# Altium project RF-BPF.PrjPcb
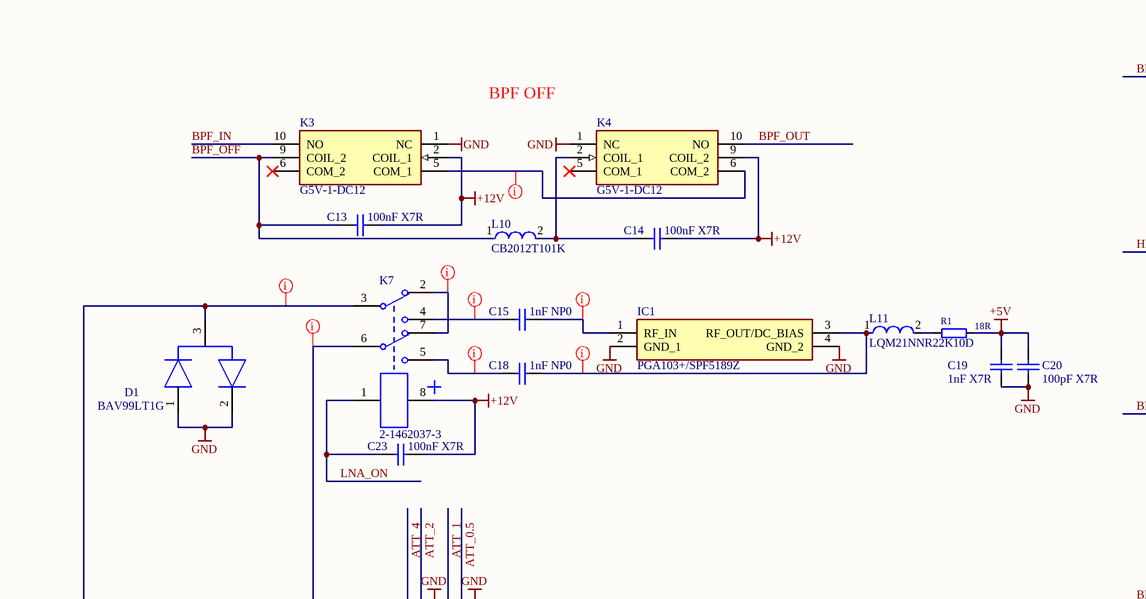
[diagram p0: RF-BPF.SchDoc, top left]
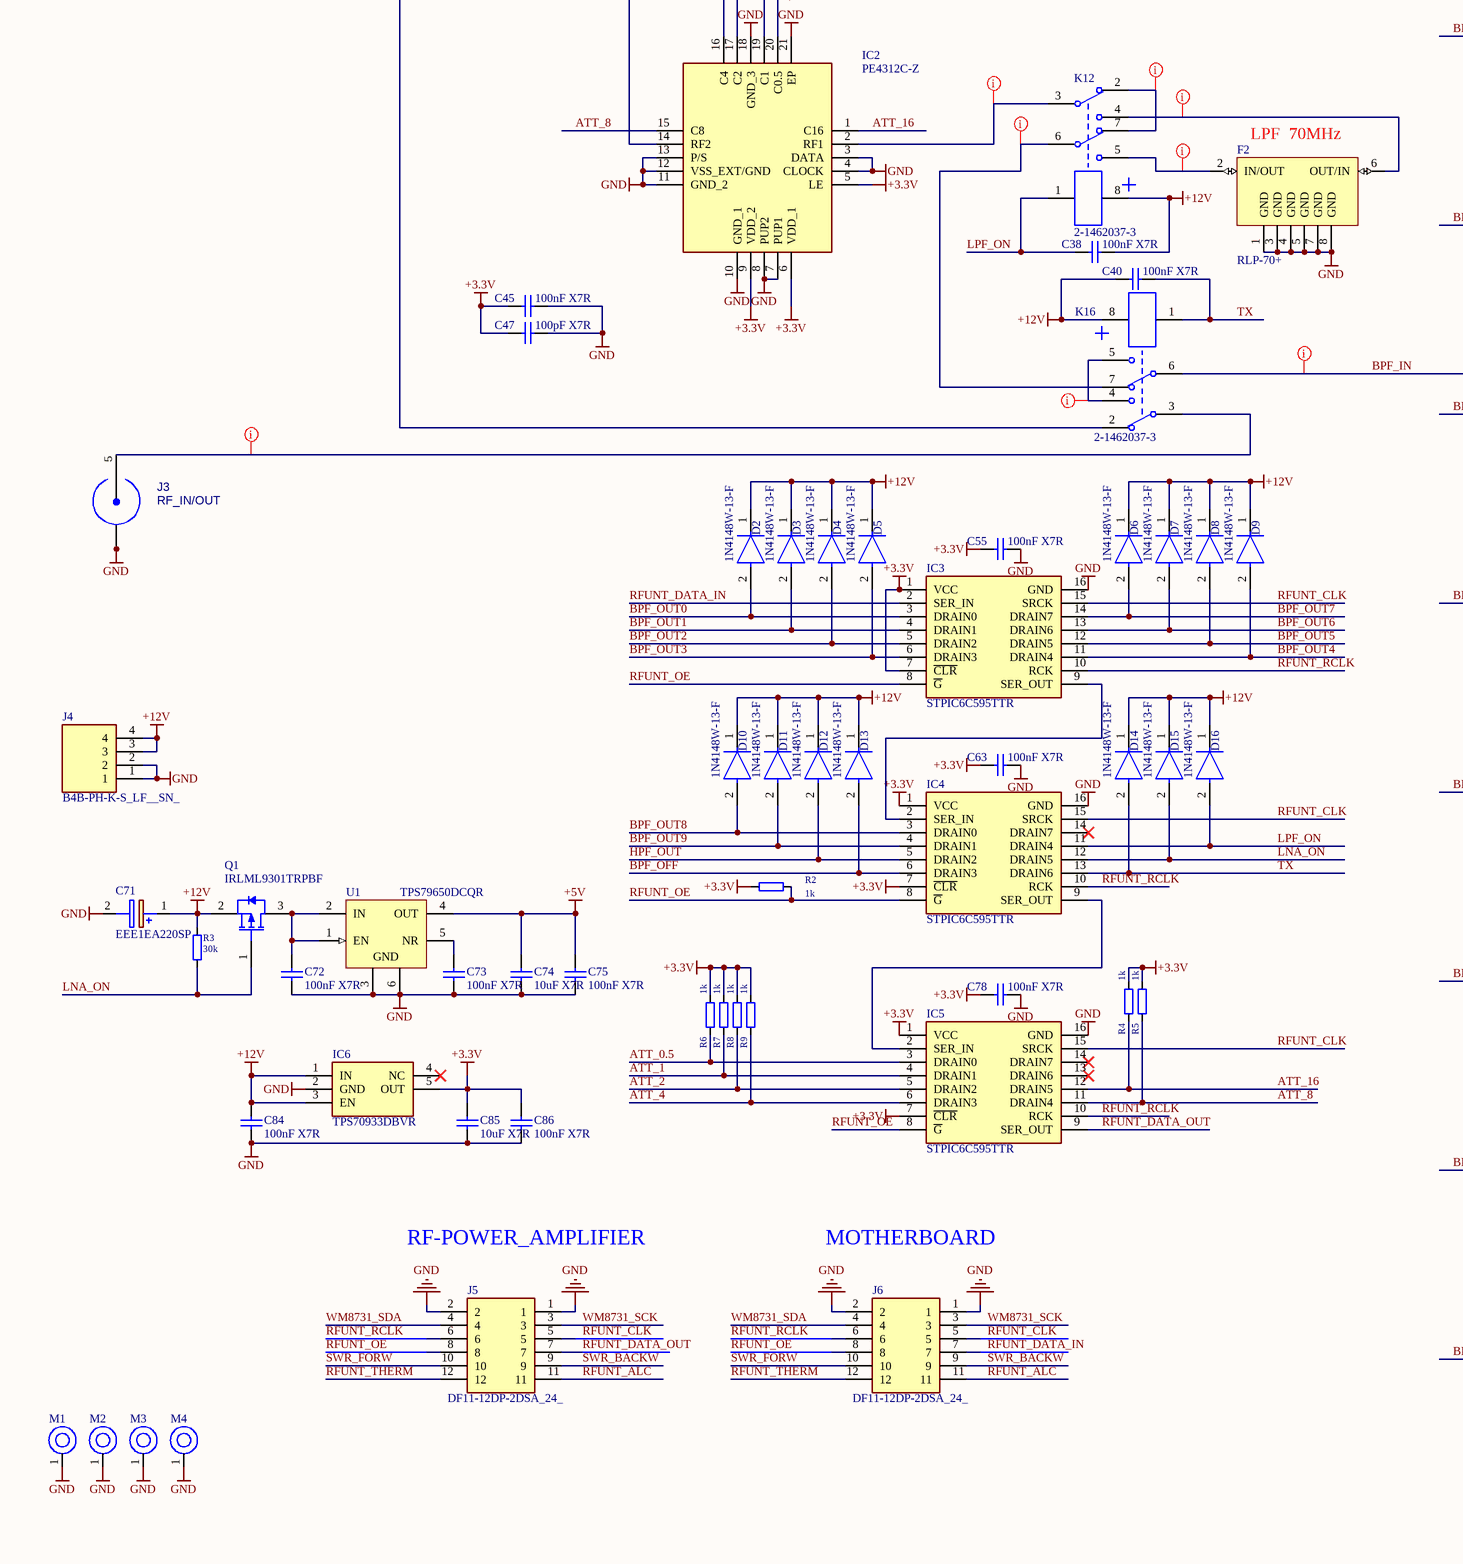
[diagram p1: RF-BPF.SchDoc, bottom left]
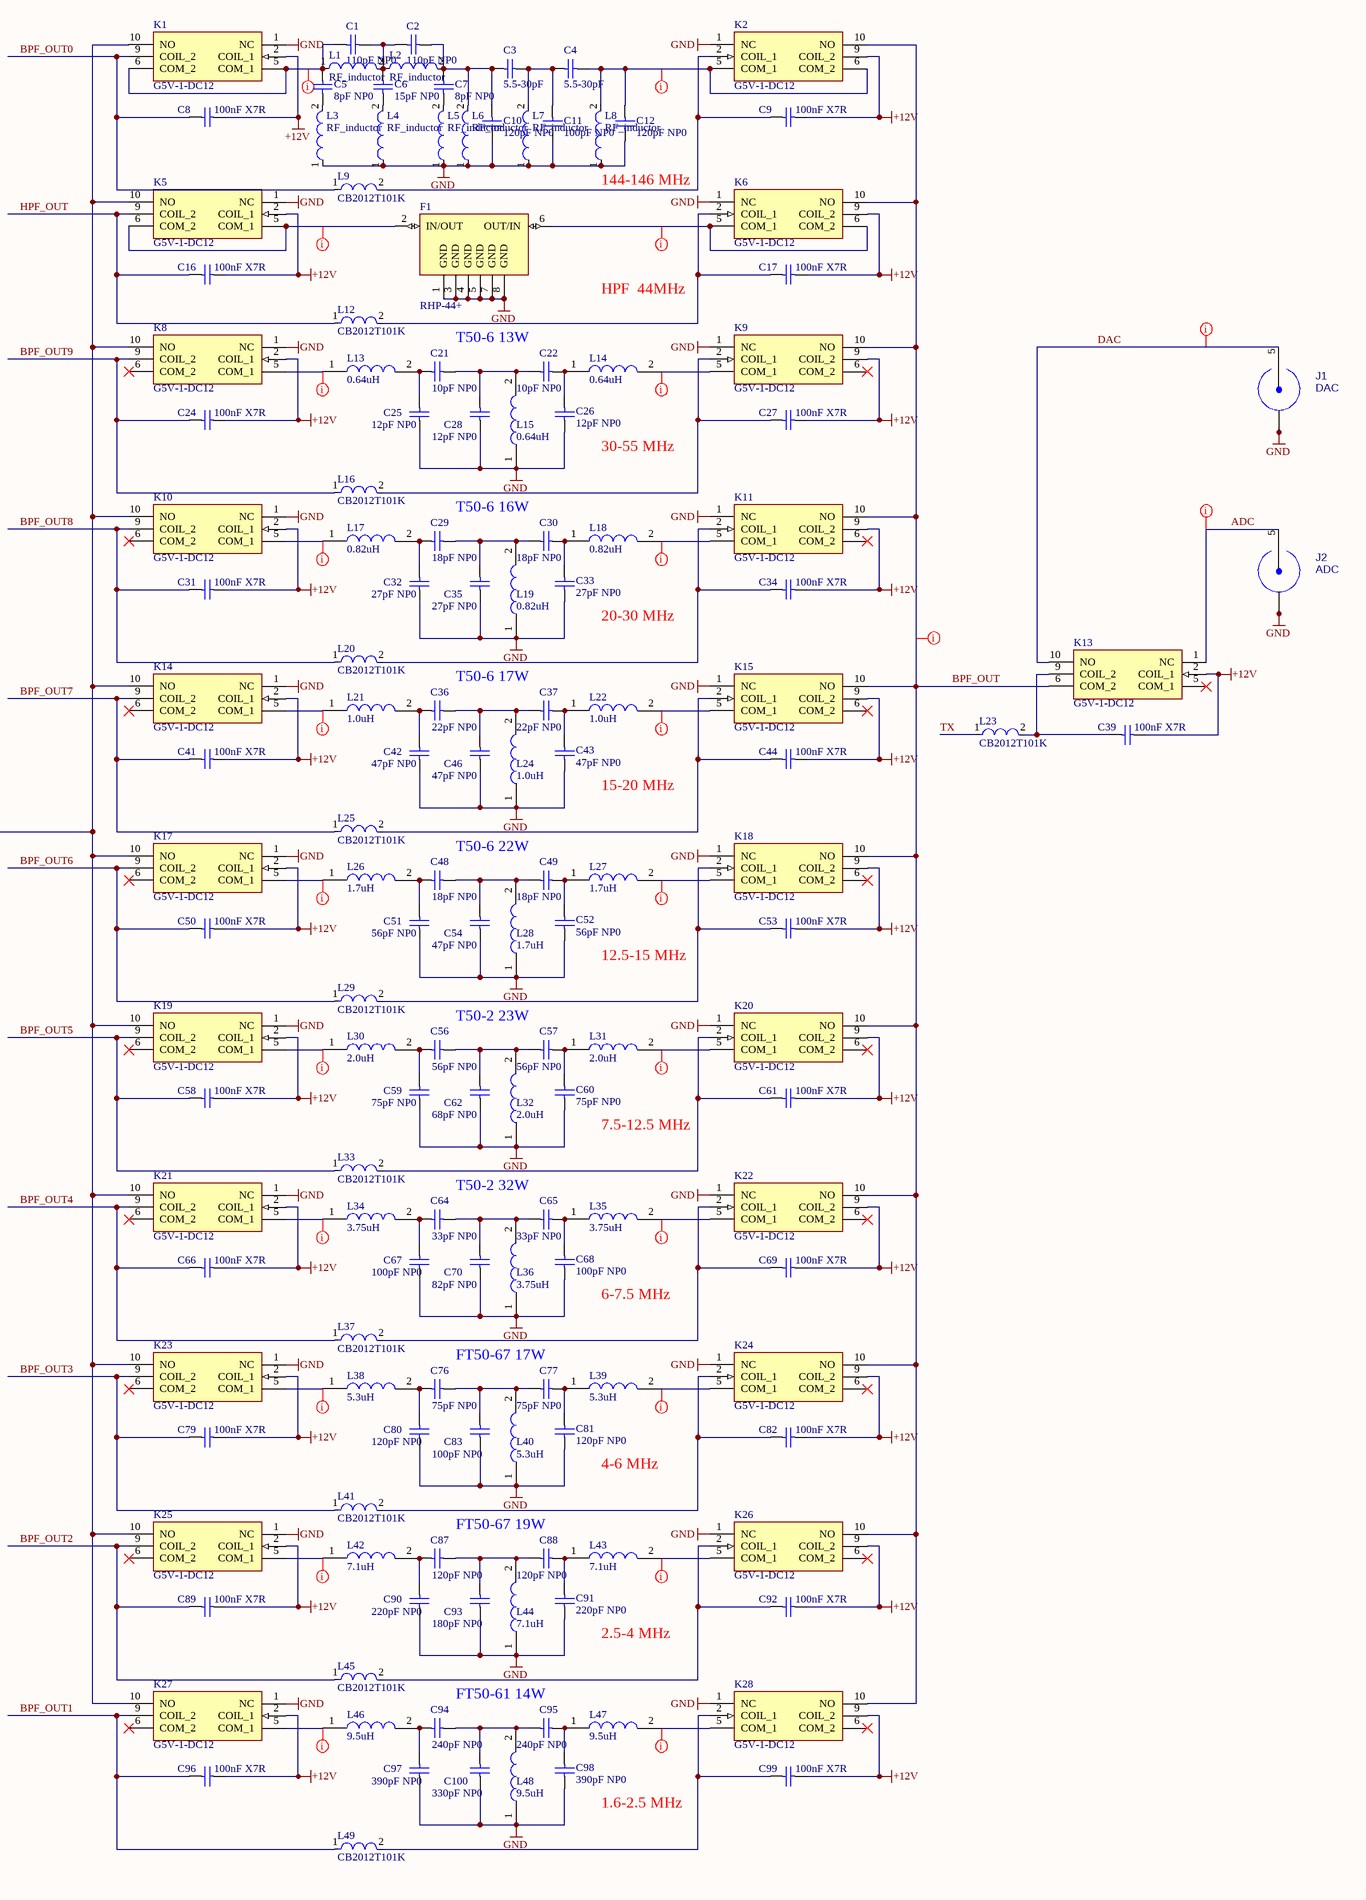
[diagram p2: RF-BPF.SchDoc, bottom right]
1 sheet, 222 parts. Net scope: global (net labels, ports and power ports of the same name join across sheets).
Board file: RF-BPF.PcbDoc

## Sheet RF-BPF.SchDoc
size A2; SheetNumber: 1; SheetTotal: 1

### Parts
C1  110pF NP0  [C-0805]
C2  110pF NP0  [C-0805]
C3  5.5-30pF  [CAP-ADJ-SMD_L4.5-W3.2-L]
C4  5.5-30pF  [CAP-ADJ-SMD_L4.5-W3.2-L]
C5  8pF NP0  [C-0805]
C6  15pF NP0  [C-0805]
C7  8pF NP0  [C-0805]
C8  100nF X7R  [C-0805]
C9  100nF X7R  [C-0805]
C10  120pF NP0  [C-0805]
C11  100pF NP0  [C-0805]
C12  120pF NP0  [C-0805]
C13  100nF X7R  [C-0805]
C14  100nF X7R  [C-0805]
C15  1nF NP0  [C-0805]
C16  100nF X7R  [C-0805]
C17  100nF X7R  [C-0805]
C18  1nF NP0  [C-0805]
C19  1nF X7R  [C-0603]
C20  100pF X7R  [C-0603]
C21  10pF NP0  [C-0805]
C22  10pF NP0  [C-0805]
C23  100nF X7R  [C-0805]
C24  100nF X7R  [C-0805]
C25  12pF NP0  [C-0805]
C26  12pF NP0  [C-0805]
C27  100nF X7R  [C-0805]
C28  12pF NP0  [C-0805]
C29  18pF NP0  [C-0805]
C30  18pF NP0  [C-0805]
C31  100nF X7R  [C-0805]
C32  27pF NP0  [C-0805]
C33  27pF NP0  [C-0805]
C34  100nF X7R  [C-0805]
C35  27pF NP0  [C-0805]
C36  22pF NP0  [C-0805]
C37  22pF NP0  [C-0805]
C38  100nF X7R  [C-0805]
C39  100nF X7R  [C-0805]
C40  100nF X7R  [C-0805]
C41  100nF X7R  [C-0805]
C42  47pF NP0  [C-0805]
C43  47pF NP0  [C-0805]
C44  100nF X7R  [C-0805]
C45  100nF X7R  [C-0603]
C46  47pF NP0  [C-0805]
C47  100pF X7R  [C-0603]
C48  18pF NP0  [C-0805]
C49  18pF NP0  [C-0805]
C50  100nF X7R  [C-0805]
C51  56pF NP0  [C-0805]
C52  56pF NP0  [C-0805]
C53  100nF X7R  [C-0805]
C54  47pF NP0  [C-0805]
C55  100nF X7R  [C-0603]
C56  56pF NP0  [C-0805]
C57  56pF NP0  [C-0805]
C58  100nF X7R  [C-0805]
C59  75pF NP0  [C-0805]
C60  75pF NP0  [C-0805]
C61  100nF X7R  [C-0805]
C62  68pF NP0  [C-0805]
C63  100nF X7R  [C-0603]
C64  33pF NP0  [C-0805]
C65  33pF NP0  [C-0805]
C66  100nF X7R  [C-0805]
C67  100pF NP0  [C-0805]
C68  100pF NP0  [C-0805]
C69  100nF X7R  [C-0805]
C70  82pF NP0  [C-0805]
C71  EEE1EA220SP  [EEE1AA101SP]
C72  100nF X7R  [C-0603]
C73  100nF X7R  [C-0603]
C74  10uF X7R  [C-0603]
C75  100nF X7R  [C-0603]
C76  75pF NP0  [C-0805]
C77  75pF NP0  [C-0805]
C78  100nF X7R  [C-0603]
C79  100nF X7R  [C-0805]
C80  120pF NP0  [C-0805]
C81  120pF NP0  [C-0805]
C82  100nF X7R  [C-0805]
C83  100pF NP0  [C-0805]
C84  100nF X7R  [C-0603]
C85  10uF X7R  [C-0603]
C86  100nF X7R  [C-0603]
C87  120pF NP0  [C-0805]
C88  120pF NP0  [C-0805]
C89  100nF X7R  [C-0805]
C90  220pF NP0  [C-0805]
C91  220pF NP0  [C-0805]
C92  100nF X7R  [C-0805]
C93  180pF NP0  [C-0805]
C94  240pF NP0  [C-0805]
C95  240pF NP0  [C-0805]
C96  100nF X7R  [C-0805]
C97  390pF NP0  [C-0805]
C98  390pF NP0  [C-0805]
C99  100nF X7R  [C-0805]
C100  330pF NP0  [C-0805]
D1  BAV99LT1G  [FP-318-08-MFG]
D2  1N4148W-13-F  [FP-SOD123-MFG]
D3  1N4148W-13-F  [FP-SOD123-MFG]
D4  1N4148W-13-F  [FP-SOD123-MFG]
D5  1N4148W-13-F  [FP-SOD123-MFG]
D6  1N4148W-13-F  [FP-SOD123-MFG]
D7  1N4148W-13-F  [FP-SOD123-MFG]
D8  1N4148W-13-F  [FP-SOD123-MFG]
D9  1N4148W-13-F  [FP-SOD123-MFG]
D10  1N4148W-13-F  [FP-SOD123-MFG]
D11  1N4148W-13-F  [FP-SOD123-MFG]
D12  1N4148W-13-F  [FP-SOD123-MFG]
D13  1N4148W-13-F  [FP-SOD123-MFG]
D14  1N4148W-13-F  [FP-SOD123-MFG]
D15  1N4148W-13-F  [FP-SOD123-MFG]
D16  1N4148W-13-F  [FP-SOD123-MFG]
F1  RHP-44+  [GP731]
F2  RLP-70+  [GP731]
IC1  PGA103+/SPF5189Z  [SPF5189Z]
IC2  PE4312C-Z  [QFN50P400X400X90-21N-D]
IC3  STPIC6C595TTR  [SOP65P640X120-16N]
IC4  STPIC6C595TTR  [SOP65P640X120-16N]
IC5  STPIC6C595TTR  [SOP65P640X120-16N]
IC6  TPS70933DBVR  [SOT95P280X145-5N]
J1  value DAC  [31-5431]  (hidden comment: ADC)
J2  ADC  [31-5431]
J3  value RF_IN/OUT  [31-5431]  (hidden comment: ADC)
J4  B4B-PH-K-S_LF__SN_  [SHDR4W50P0X200_1X4_990X450X600P]
J5  DF11-12DP-2DSA_24_  [SHDR12W60P200_2X6_1400X500X690P]
J6  DF11-12DP-2DSA_24_  [SHDR12W60P200_2X6_1400X500X690P]
K1  G5V-1-DC12  [G5V1DC12]
K2  G5V-1-DC12  [G5V1DC12]
K3  G5V-1-DC12  [G5V1DC12]
K4  G5V-1-DC12  [G5V1DC12]
K5  G5V-1-DC12  [G5V1DC12]
K6  G5V-1-DC12  [G5V1DC12]
K7  2-1462037-3  [TECO-2-1462037-3_V]
K8  G5V-1-DC12  [G5V1DC12]
K9  G5V-1-DC12  [G5V1DC12]
K10  G5V-1-DC12  [G5V1DC12]
K11  G5V-1-DC12  [G5V1DC12]
K12  2-1462037-3  [TECO-2-1462037-3_V]
K13  G5V-1-DC12  [G5V1DC12]
K14  G5V-1-DC12  [G5V1DC12]
K15  G5V-1-DC12  [G5V1DC12]
K16  2-1462037-3  [TECO-2-1462037-3_V]
K17  G5V-1-DC12  [G5V1DC12]
K18  G5V-1-DC12  [G5V1DC12]
K19  G5V-1-DC12  [G5V1DC12]
K20  G5V-1-DC12  [G5V1DC12]
K21  G5V-1-DC12  [G5V1DC12]
K22  G5V-1-DC12  [G5V1DC12]
K23  G5V-1-DC12  [G5V1DC12]
K24  G5V-1-DC12  [G5V1DC12]
K25  G5V-1-DC12  [G5V1DC12]
K26  G5V-1-DC12  [G5V1DC12]
K27  G5V-1-DC12  [G5V1DC12]
K28  G5V-1-DC12  [G5V1DC12]
L1  RF_inductor  [L-2520]
L2  RF_inductor  [L-2520]
L3  RF_inductor  [3.81x3.43x4.95]
L4  RF_inductor  [3.81x3.43x4.95]
L5  RF_inductor  [3.81x3.43x4.95]
L6  RF_inductor  [L-0805]
L7  RF_inductor  [L-0805]
L8  RF_inductor  [L-0805]
L9  CB2012T101K  [FP-CB2012-MFG]
L10  CB2012T101K  [FP-CB2012-MFG]
L11  LQM21NNR22K10D  [FP-LQM21DN_00-IPC_C]
L12  CB2012T101K  [FP-CB2012-MFG]
L13  0.64uH  [Amidon_T50_6]
L14  0.64uH  [Amidon_T50_6]
L15  0.64uH  [Amidon_T50_6]
L16  CB2012T101K  [FP-CB2012-MFG]
L17  0.82uH  [Amidon_T50_6]
L18  0.82uH  [Amidon_T50_6]
L19  0.82uH  [Amidon_T50_6]
L20  CB2012T101K  [FP-CB2012-MFG]
L21  1.0uH  [Amidon_T50_6]
L22  1.0uH  [Amidon_T50_6]
L23  CB2012T101K  [FP-CB2012-MFG]
L24  1.0uH  [Amidon_T50_6]
L25  CB2012T101K  [FP-CB2012-MFG]
L26  1.7uH  [Amidon_T50_6]
L27  1.7uH  [Amidon_T50_6]
L28  1.7uH  [Amidon_T50_6]
L29  CB2012T101K  [FP-CB2012-MFG]
L30  2.0uH  [Amidon_T50_2]
L31  2.0uH  [Amidon_T50_2]
L32  2.0uH  [Amidon_T50_2]
L33  CB2012T101K  [FP-CB2012-MFG]
L34  3.75uH  [Amidon_T50_2]
L35  3.75uH  [Amidon_T50_2]
L36  3.75uH  [Amidon_T50_2]
L37  CB2012T101K  [FP-CB2012-MFG]
L38  5.3uH  [Amidon_FT50_6x]
L39  5.3uH  [Amidon_FT50_6x]
L40  5.3uH  [Amidon_FT50_6x]
L41  CB2012T101K  [FP-CB2012-MFG]
L42  7.1uH  [Amidon_FT50_6x]
L43  7.1uH  [Amidon_FT50_6x]
L44  7.1uH  [Amidon_FT50_6x]
L45  CB2012T101K  [FP-CB2012-MFG]
L46  9.5uH  [Amidon_FT50_6x]
L47  9.5uH  [Amidon_FT50_6x]
L48  9.5uH  [Amidon_FT50_6x]
L49  CB2012T101K  [FP-CB2012-MFG]
M1  MountHole  [MountHole]  (value not drawn)
M2  MountHole  [MountHole]  (value not drawn)
M3  MountHole  [MountHole]  (value not drawn)
M4  MountHole  [MountHole]  (value not drawn)
Q1  IRLML9301TRPBF  [INF-SOT-23-3_V]
R1  18R  [R-0603]
R2  1k  [R-0603]
R3  30k  [R-0603]
R4  1k  [R-0603]
R5  1k  [R-0603]
R6  1k  [R-0603]
R7  1k  [R-0603]
R8  1k  [R-0603]
R9  1k  [R-0603]
U1  TPS79650DCQR  [DCQ0006A_L]

### Nets
+3.3V: C45.1 C47.1 C55.1 C63.1 C78.1 C85.2 C86.2 IC2.5(LE) IC2.6(VDD_1) IC2.9(VDD_2) IC3.1(VCC) IC3.7(~{CLR}) IC4.1(VCC) IC4.7(~{CLR}) IC5.1(VCC) IC5.7(~{CLR}) IC6.5(OUT) R2.2 R4.2 R5.2 R6.2 R7.2 R8.2 R9.2
+5V: C19.2 C20.2 C74.2 C75.2 R1.2 U1.4(OUT)
+12V: C8.2 C9.2 C13.2 C14.2 C16.2 C17.2 C23.2 C24.2 C27.2 C31.2 C34.2 C38.2 C39.2 C40.2 C41.2 C44.2 C50.2 C53.2 C58.2 C61.2 C66.2 C69.2 C71.1(+) C79.2 C82.2 C84.2 C89.2 C92.2 C96.2 C99.2 D2.1(C) D3.1(C) D4.1(C) D5.1(C) D6.1(C) D7.1(C) D8.1(C) D9.1(C) D10.1(C) D11.1(C) D12.1(C) D13.1(C) D14.1(C) D15.1(C) D16.1(C) IC6.1(IN) IC6.3(EN) J4.3 J4.4 K1.2(COIL_1) K2.9(COIL_2) K3.2(COIL_1) K4.9(COIL_2) K5.2(COIL_1) K6.9(COIL_2) K7.8 K8.2(COIL_1) K9.9(COIL_2) K10.2(COIL_1) K11.9(COIL_2) K12.8 K13.2(COIL_1) K14.2(COIL_1) K15.9(COIL_2) K16.8 K17.2(COIL_1) K18.9(COIL_2) K19.2(COIL_1) K20.9(COIL_2) K21.2(COIL_1) K22.9(COIL_2) K23.2(COIL_1) K24.9(COIL_2) K25.2(COIL_1) K26.9(COIL_2) K27.2(COIL_1) K28.9(COIL_2) Q1.2(SOURCE) R3.1
GND: C10.2 C11.2 C12.2 C19.1 C20.1 C25.2 C26.2 C28.2 C32.2 C33.2 C35.2 C42.2 C43.2 C45.2 C46.2 C47.2 C51.2 C52.2 C54.2 C55.2 C59.2 C60.2 C62.2 C63.2 C67.2 C68.2 C70.2 C71.2(-) C72.1 C73.1 C74.1 C75.1 C78.2 C80.2 C81.2 C83.2 C84.1 C85.1 C86.1 C90.2 C91.2 C93.2 C97.2 C98.2 C100.2 D1.1(A) D1.2(C) F1.1(GND) F1.3(GND) F1.4(GND) F1.5(GND) F1.7(GND) F1.8(GND) F2.1(GND) F2.3(GND) F2.4(GND) F2.5(GND) F2.7(GND) F2.8(GND) IC1.2(GND_1) IC1.4(GND_2) IC2.3(DATA) IC2.4(CLOCK) IC2.7(PUP1) IC2.8(PUP2) IC2.10(GND_1) IC2.11(GND_2) IC2.12(VSS_EXT/GND) IC2.13(P/S) IC2.18(GND_3) IC2.21(EP) IC3.16(GND) IC4.16(GND) IC5.16(GND) IC6.2(GND) J1.1(GND) J1.2(GND) J1.3(GND) J1.4(GND) J2.1(GND) J2.2(GND) J2.3(GND) J2.4(GND) J3.1(GND) J3.2(GND) J3.3(GND) J3.4(GND) J4.1 J4.2 J5.1 J5.2 J6.1 J6.2 K1.1(NC) K2.1(NC) K3.1(NC) K4.1(NC) K5.1(NC) K6.1(NC) K8.1(NC) K9.1(NC) K10.1(NC) K11.1(NC) K14.1(NC) K15.1(NC) K17.1(NC) K18.1(NC) K19.1(NC) K20.1(NC) K21.1(NC) K22.1(NC) K23.1(NC) K24.1(NC) K25.1(NC) K26.1(NC) K27.1(NC) K28.1(NC) L3.1 L4.1 L5.1 L6.1 L7.1 L8.1 L15.1 L19.1 L24.1 L28.1 L32.1 L36.1 L40.1 L44.1 L48.1 M1.1 M2.1 M3.1 M4.1 U1.3(GND) U1.6(GND)
ADC: J2.5(CON) K13.1(NC)
ATT_0.5: IC2.20(C0.5) IC5.3(DRAIN0) R6.1
ATT_1: IC2.19(C1) IC5.4(DRAIN1) R7.1
ATT_2: IC2.17(C2) IC5.5(DRAIN2) R8.1
ATT_4: IC2.16(C4) IC5.6(DRAIN3) R9.1
ATT_8: IC2.15(C8) IC5.11(DRAIN4) R5.1
ATT_16: IC2.1(C16) IC5.12(DRAIN5) R4.1
BPF_IN: K1.10(NO) K3.10(NO) K5.10(NO) K8.10(NO) K10.10(NO) K14.10(NO) K16.6 K17.10(NO) K19.10(NO) K21.10(NO) K23.10(NO) K25.10(NO) K27.10(NO)
BPF_OFF: C13.1 D13.2(A) IC4.6(DRAIN3) K3.9(COIL_2) L10.1
BPF_OUT: K2.10(NO) K4.10(NO) K6.10(NO) K9.10(NO) K11.10(NO) K13.6(COM_2) K15.10(NO) K18.10(NO) K20.10(NO) K22.10(NO) K24.10(NO) K26.10(NO) K28.10(NO)
BPF_OUT0: C8.1 D2.2(A) IC3.3(DRAIN0) K1.9(COIL_2) L9.1
BPF_OUT1: C96.1 D3.2(A) IC3.4(DRAIN1) K27.9(COIL_2) L49.1
BPF_OUT2: C89.1 D4.2(A) IC3.5(DRAIN2) K25.9(COIL_2) L45.1
BPF_OUT3: C79.1 D5.2(A) IC3.6(DRAIN3) K23.9(COIL_2) L41.1
BPF_OUT4: C66.1 D9.2(A) IC3.11(DRAIN4) K21.9(COIL_2) L37.1
BPF_OUT5: C58.1 D8.2(A) IC3.12(DRAIN5) K19.9(COIL_2) L33.1
BPF_OUT6: C50.1 D7.2(A) IC3.13(DRAIN6) K17.9(COIL_2) L29.1
BPF_OUT7: C41.1 D6.2(A) IC3.14(DRAIN7) K14.9(COIL_2) L25.1
BPF_OUT8: C31.1 D10.2(A) IC4.3(DRAIN0) K10.9(COIL_2) L20.1
BPF_OUT9: C24.1 D11.2(A) IC4.4(DRAIN1) K8.9(COIL_2) L16.1
DAC: J1.5(CON) K13.10(NO)
HPF_OUT: C16.1 D12.2(A) IC4.5(DRAIN2) K5.9(COIL_2) L12.1
LNA_ON: C23.1 D15.2(A) IC4.12(DRAIN5) K7.1 Q1.1(GATE) R3.2
LPF_ON: C38.1 D16.2(A) IC4.11(DRAIN4) K12.1
RFUNT_ALC: J5.11 J6.11
RFUNT_CLK: IC3.15(SRCK) IC4.15(SRCK) IC5.15(SRCK) J5.5 J6.5
RFUNT_DATA_IN: IC3.2(SER_IN) J6.7
RFUNT_DATA_OUT: IC5.9(SER_OUT) J5.7
RFUNT_OE: IC3.8(~{G}) IC4.8(~{G}) IC5.8(~{G}) J5.8 J6.8 R2.1
RFUNT_RCLK: IC3.10(RCK) IC4.10(RCK) IC5.10(RCK) J5.6 J6.6
RFUNT_THERM: J5.12 J6.12
SWR_BACKW: J5.9 J6.9
SWR_FORW: J5.10 J6.10
TX: C40.1 D14.2(A) IC4.13(DRAIN6) K16.1 L23.1
WM8731_SCK: J5.3 J6.3
WM8731_SDA: J5.4 J6.4
NetC1_1: C1.1 C2.2 C6.2 L1.2 L2.1
NetC1_2: C1.2 C5.2 K1.5(COM_1) K1.6(COM_2) L1.1
NetC2_1: C2.1 C3.1 C7.2 C10.1 L2.2 L6.2
NetC3_2: C3.2 C4.1 C11.1 L7.2
NetC4_2: C4.2 C12.1 K2.5(COM_1) K2.6(COM_2) L8.2
NetC5_1: C5.1 L3.2
NetC6_1: C6.1 L4.2
NetC7_1: C7.1 L5.2
NetC9_1: C9.1 K2.2(COIL_1) L9.2
NetC14_1: C14.1 K4.2(COIL_1) L10.2
NetC15_1: C15.1 K7.4
NetC15_2: C15.2 IC1.1(RF_IN)
NetC17_1: C17.1 K6.2(COIL_1) L12.2
NetC18_1: C18.1 K7.5
NetC18_2: C18.2 IC1.3(RF_OUT/DC_BIAS) L11.1
NetC21_1: C21.1 C25.1 L13.2
NetC21_2: C21.2 C22.1 C28.1 L15.2
NetC22_2: C22.2 C26.1 L14.1
NetC27_1: C27.1 K9.2(COIL_1) L16.2
NetC29_1: C29.1 C32.1 L17.2
NetC29_2: C29.2 C30.1 C35.1 L19.2
NetC30_2: C30.2 C33.1 L18.1
NetC34_1: C34.1 K11.2(COIL_1) L20.2
NetC36_1: C36.1 C42.1 L21.2
NetC36_2: C36.2 C37.1 C46.1 L24.2
NetC37_2: C37.2 C43.1 L22.1
NetC39_1: C39.1 K13.9(COIL_2) L23.2
NetC44_1: C44.1 K15.2(COIL_1) L25.2
NetC48_1: C48.1 C51.1 L26.2
NetC48_2: C48.2 C49.1 C54.1 L28.2
NetC49_2: C49.2 C52.1 L27.1
NetC53_1: C53.1 K18.2(COIL_1) L29.2
NetC56_1: C56.1 C59.1 L30.2
NetC56_2: C56.2 C57.1 C62.1 L32.2
NetC57_2: C57.2 C60.1 L31.1
NetC61_1: C61.1 K20.2(COIL_1) L33.2
NetC64_1: C64.1 C67.1 L34.2
NetC64_2: C64.2 C65.1 C70.1 L36.2
NetC65_2: C65.2 C68.1 L35.1
NetC69_1: C69.1 K22.2(COIL_1) L37.2
NetC72_2: C72.2 Q1.3(DRAIN) U1.1(EN) U1.2(IN)
NetC73_2: C73.2 U1.5(NR)
NetC76_1: C76.1 C80.1 L38.2
NetC76_2: C76.2 C77.1 C83.1 L40.2
NetC77_2: C77.2 C81.1 L39.1
NetC82_1: C82.1 K24.2(COIL_1) L41.2
NetC87_1: C87.1 C90.1 L42.2
NetC87_2: C87.2 C88.1 C93.1 L44.2
NetC88_2: C88.2 C91.1 L43.1
NetC92_1: C92.1 K26.2(COIL_1) L45.2
NetC94_1: C94.1 C97.1 L46.2
NetC94_2: C94.2 C95.1 C100.1 L48.2
NetC95_2: C95.2 C98.1 L47.1
NetC99_1: C99.1 K28.2(COIL_1) L49.2
NetD1_3: D1.3(CATHODE/ANODE) K7.3 K16.2
NetF1_2: F1.2(IN/OUT) K5.5(COM_1) K5.6(COM_2)
NetF1_6: F1.6(OUT/IN) K6.5(COM_1) K6.6(COM_2)
NetF2_2: F2.2(IN/OUT) K12.5
NetF2_6: F2.6(OUT/IN) K12.4
NetIC2_2: IC2.2(RF1) K12.3
NetIC2_14: IC2.14(RF2) K7.6
NetIC3_9: IC3.9(SER_OUT) IC4.2(SER_IN)
NetIC4_9: IC4.9(SER_OUT) IC5.2(SER_IN)
NetJ3_5: J3.5(CON) K16.3
NetK3_5: K3.5(COM_1) K4.6(COM_2)
NetK7_2: K7.2 K7.7
NetK8_5: K8.5(COM_1) L13.1
NetK9_5: K9.5(COM_1) L14.2
NetK10_5: K10.5(COM_1) L17.1
NetK11_5: K11.5(COM_1) L18.2
NetK12_2: K12.2 K12.7
NetK12_6: K12.6 K16.7
NetK14_5: K14.5(COM_1) L21.1
NetK15_5: K15.5(COM_1) L22.2
NetK16_4: K16.4 K16.5
NetK17_5: K17.5(COM_1) L26.1
NetK18_5: K18.5(COM_1) L27.2
NetK19_5: K19.5(COM_1) L30.1
NetK20_5: K20.5(COM_1) L31.2
NetK21_5: K21.5(COM_1) L34.1
NetK22_5: K22.5(COM_1) L35.2
NetK23_5: K23.5(COM_1) L38.1
NetK24_5: K24.5(COM_1) L39.2
NetK25_5: K25.5(COM_1) L42.1
NetK26_5: K26.5(COM_1) L43.2
NetK27_5: K27.5(COM_1) L46.1
NetK28_5: K28.5(COM_1) L47.2
NetL11_2: L11.2 R1.1

Not connected (* = marked no-connect by the designer): IC4 14(DRAIN7)*; IC5 13(DRAIN6)* 14(DRAIN7)*; IC6 4(NC)*; K3 6(COM_2)*; K4 5(COM_1)*; K8 6(COM_2)*; K9 6(COM_2)*; K10 6(COM_2)*; K11 6(COM_2)*; K13 5(COM_1)*; K14 6(COM_2)*; K15 6(COM_2)*; K17 6(COM_2)*; K18 6(COM_2)*; K19 6(COM_2)*; K20 6(COM_2)*; K21 6(COM_2)*; K22 6(COM_2)*; K23 6(COM_2)*; K24 6(COM_2)*; K25 6(COM_2)*; K26 6(COM_2)*; K27 6(COM_2)*; K28 6(COM_2)*

### Layout directives
net class RF_SIGNAL_50ohm; rule Width Constraint [Pref Impedance = 50,00ohms    Min Impedance = 50,00ohms    Max Impedance = 50,00ohms]; rule Width Constraint [Pref Impedance = 50,00ohms    Min Impedance = 50,00ohms    Max Impedance = 50,00ohms]: ADC, BPF_IN, BPF_OUT, DAC, NetC1_2, NetC4_2, NetC15_1, NetC15_2, NetC18_1, NetC18_2, NetD1_3, NetF1_2, NetF1_6, NetF2_2, NetF2_6, NetIC2_2, NetIC2_14, NetJ3_5, NetK3_5, NetK7_2, NetK8_5, NetK9_5, NetK10_5, NetK11_5, NetK12_2, NetK12_6, NetK14_5, NetK15_5, NetK16_4, NetK17_5, NetK18_5, NetK19_5, NetK20_5, NetK21_5, NetK22_5, NetK23_5, NetK24_5, NetK25_5, NetK26_5, NetK27_5, NetK28_5

### Notes on the sheet
- BPF OFF
- (near L8) 144-146 MHz
- T50-6 13W
- HPF  44MHz
- (near C26) 30-55 MHz
- T50-6 16W
- (near F2) LPF  70MHz
- (near C33) 20-30 MHz
- T50-6 17W
- (near C43) 15-20 MHz
- T50-6 22W
- (near C52) 12.5-15 MHz
- T50-2 23W
- (near C60) 7.5-12.5 MHz
- T50-2 32W
- (near C68) 6-7.5 MHz
- FT50-67 17W
- (near C81) 4-6 MHz
- FT50-67 19W
- RF-POWER_AMPLIFIER
- MOTHERBOARD
- (near C91) 2.5-4 MHz
- FT50-61 14W
- (near C98) 1.6-2.5 MHz

### Library data of the parts
C1-C20 C23 C24 C27 C31 C34 C38-C41 C44 C45 C47 C50 C53 C55 C58 C61 C63 C66 C69 C72-C75 C78 C79 C82 C84-C86 C89 C92 C96 C99 = C semi: Ceramic Multilayer Capacitor; Manufacturer: Yageo/Phycomp; Manufacturer P/N: CC0603JRNPO9BN102; numsch: 011; TypeNum: 155; Parameters: 1nF, NP0, 50V, ±5%; Tolerance: ±10%; Voltage: *
C21 C22 = C semi: Ceramic Multilayer Capacitor; Manufacturer: Yageo/Phycomp; Manufacturer P/N: CC0805JRNPO9BN100; numsch: 011; TypeNum: 155; Parameters: 1nF, NP0, 50V, ±5%; Tolerance: ±10%; Voltage: *
C25 C26 C28 = C semi: Ceramic Multilayer Capacitor; Manufacturer: Yageo/Phycomp; Manufacturer P/N: CC0805JRNPO9BN120; numsch: 011; TypeNum: 155; Parameters: 1nF, NP0, 50V, ±5%; Tolerance: ±10%; Voltage: *
C29 C30 C48 C49 = C semi: Ceramic Multilayer Capacitor; Manufacturer: Yageo/Phycomp; Manufacturer P/N: CC0805JRNPO9BN180; numsch: 011; TypeNum: 155; Parameters: 1nF, NP0, 50V, ±5%; Tolerance: ±10%; Voltage: *
C32 C33 C35 = C semi: Ceramic Multilayer Capacitor; Manufacturer: Yageo/Phycomp; Manufacturer P/N: GRM21A5C2J270JWA1D; numsch: 011; TypeNum: 155; Parameters: 1nF, NP0, 50V, ±5%; Tolerance: ±10%; Voltage: *
C36 C37 = C semi: Ceramic Multilayer Capacitor; Manufacturer: Yageo/Phycomp; Manufacturer P/N: GRM21A5C2D220JW01D; numsch: 011; TypeNum: 155; Parameters: 1nF, NP0, 50V, ±5%; Tolerance: ±10%; Voltage: *
C42 C43 C46 C54 = C semi: Ceramic Multilayer Capacitor; Manufacturer: Yageo/Phycomp; Manufacturer P/N: CC0805JRNPO9BN470; numsch: 011; TypeNum: 155; Parameters: 1nF, NP0, 50V, ±5%; Tolerance: ±10%; Voltage: *
C51 C52 C56 C57 = C semi: Ceramic Multilayer Capacitor; Manufacturer: Yageo/Phycomp; Manufacturer P/N: CC0805JRNPO9BN560; numsch: 011; TypeNum: 155; Parameters: 1nF, NP0, 50V, ±5%; Tolerance: ±10%; Voltage: *
C59 C60 C76 C77 = C semi: Ceramic Multilayer Capacitor; Manufacturer: Yageo/Phycomp; Manufacturer P/N: GRM1885C1H750JA01D; numsch: 011; TypeNum: 155; Parameters: 1nF, NP0, 50V, ±5%; Tolerance: ±10%; Voltage: *
C62 = C semi: Ceramic Multilayer Capacitor; Manufacturer: Yageo/Phycomp; Manufacturer P/N: CC0805JRNPO9BN680; numsch: 011; TypeNum: 155; Parameters: 1nF, NP0, 50V, ±5%; Tolerance: ±10%; Voltage: *
C64 C65 = C semi: Ceramic Multilayer Capacitor; Manufacturer: Yageo/Phycomp; Manufacturer P/N: GRM21A5C2E330JW01D; numsch: 011; TypeNum: 155; Parameters: 1nF, NP0, 50V, ±5%; Tolerance: ±10%; Voltage: *
C67 C68 C83 = C semi: Ceramic Multilayer Capacitor; Manufacturer: Yageo/Phycomp; Manufacturer P/N: CC0805JRNPO9BN101; numsch: 011; TypeNum: 155; Parameters: 1nF, NP0, 50V, ±5%; Tolerance: ±10%; Voltage: *
C70 = C semi: Ceramic Multilayer Capacitor; Manufacturer: Yageo/Phycomp; Manufacturer P/N: CC0805JRNPO9BN820; numsch: 011; TypeNum: 155; Parameters: 1nF, NP0, 50V, ±5%; Tolerance: ±10%; Voltage: *
C71 = EEE1EA220SP: Capacitor Polarised; Manufacturer_Name: Panasonic; Datasheet Link: http://industrial.panasonic.com/cdbs/www-data/pdf/RDE0000/ABA0000C1145.pdf; Height: 7.8mm; Manufacturer_Part_Number: EEE1EA220SP
C80 C81 C87 C88 = C semi: Ceramic Multilayer Capacitor; Manufacturer: Yageo/Phycomp; Manufacturer P/N: CC0805JRNPO9BN121; numsch: 011; TypeNum: 155; Parameters: 1nF, NP0, 50V, ±5%; Tolerance: ±10%; Voltage: *
C90 C91 = C semi: Ceramic Multilayer Capacitor; Manufacturer: Yageo/Phycomp; Manufacturer P/N: CC0805JRNPO9BN221; numsch: 011; TypeNum: 155; Parameters: 1nF, NP0, 50V, ±5%; Tolerance: ±10%; Voltage: *
C93 = C semi: Ceramic Multilayer Capacitor; Manufacturer: Yageo/Phycomp; Manufacturer P/N: CC0805JRNPO9BN181; numsch: 011; TypeNum: 155; Parameters: 1nF, NP0, 50V, ±5%; Tolerance: ±10%; Voltage: *
C94 C95 = C semi: Ceramic Multilayer Capacitor; Manufacturer: Yageo/Phycomp; Manufacturer P/N: GRM2165C2A241JA01D; numsch: 011; TypeNum: 155; Parameters: 1nF, NP0, 50V, ±5%; Tolerance: ±10%; Voltage: *
C97 C98 = C semi: Ceramic Multilayer Capacitor; Manufacturer: Yageo/Phycomp; Manufacturer P/N: GRM2165C1H391JA01D; numsch: 011; TypeNum: 155; Parameters: 1nF, NP0, 50V, ±5%; Tolerance: ±10%; Voltage: *
C100 = C semi: Ceramic Multilayer Capacitor; Manufacturer: Yageo/Phycomp; Manufacturer P/N: CC0805JRNPO9BN331; numsch: 011; TypeNum: 155; Parameters: 1nF, NP0, 50V, ±5%; Tolerance: ±10%; Voltage: *
D1 = CMP-07163-000036-1: DIODE ARRAY 100V 215MA SOT23-3; Capacitance: 1.5pF; Current Rating: 200mA; Max Repetitive Reverse Voltage (Vrrm): 70V; Forward Voltage: 1.25V; Max Forward Surge Current (Ifsm): 500mA; Peak Reverse Current: 2.5uA; Forward Current: 150mA; Peak Non-Repetitive Surge Current: 2A; Reverse Recovery Time: 6ns; Length: 2.9mm; Voltage Rating (DC): 70V; Case/Package: SOT-23; Height: 0.94mm; Number of Pins: 3; Mount: Surface Mount; Min Operating Temperature: -65°C; Lead Free: Lead Free; REACH SVHC: No SVHC; Width: 1.3mm; Packaging: Tape and Reel; Max Operating Temperature: 150°C
D2-D16 = CMP-12791-000005-1: DIODE GEN PURP 100V 150MA SOD123; Manufacturer: Diodes Inc.; Capacitance: 2pF; Forward Current: 300mA; Max Junction Temp: +150°C; Value: 2pF; Standoff Height: 0mm; Peak Reverse Current: 1uA; Max Surge Forward Current: 1A; Category: Diode; Height: 1.45mm; ComponentLink2URL: https://upverter.com/datasheet/628e7d6fee5901eee6eef4567d1c3569f2cd3cde.pdf; Lead Free: Yes; ComponentLink2Description: Datasheet; Octopart: https://octopart.com/1n4148w-13-f-diodes+inc.-2359612; Temperature Range High: +150°C; Device Class L2: Diodes; Digikey Description: DIODE GEN PURP 100V 150MA SOD123; Reverse Voltage: 100V; Temperature Range Low: -65°C; Device Class L1: Discrete Semiconductors; Package: SOD123; RoHS: TRUE; Manufacturer Part Number: 1N4148W-13-F; Footprint Url: https://www.diodes.com/assets/Package-Files/SOD123.pdf; Automotive: No; Max Repetitive Reverse Voltage: 100V; Mouser Description: 1N4148W Series 2 A 100 V 400 mW Surface Mount Fast Switching Diode - SOD-123; Temperature: -65°C to +150°C; Device Class L3: Rectifier Diodes
IC1 = SPF5189Z: Integrated Circuit; Manufacturer_Name: RFMD; Datasheet Link: https://componentsearchengine.com/Datasheets/2/SPF5189Z.pdf; Height: 1.5mm; Manufacturer_Part_Number: SPF5189Z
IC2 = PE4312C-Z: Integrated Circuit; Manufacturer_Name: Peregrine Semiconductor; Datasheet Link: https://www.psemi.com/pdf/datasheets/pe4312ds.pdf; Height: 0.9mm; Manufacturer_Part_Number: PE4312C-Z
IC3-IC5 = STPIC6C595TTR: Integrated Circuit; Manufacturer_Name: STMicroelectronics; Datasheet Link: http://www.st.com/st-web-ui/static/active/en/resource/technical/document/datasheet/CD00020664.pdf; Height: 1.2mm; Manufacturer_Part_Number: STPIC6C595TTR; Mouser Part Number: 511-STPIC6C595T; Mouser Price/Stock: https://www.mouser.co.uk/ProductDetail/STMicroelectronics/STPIC6C595TTR?qs=Pgvhs884FskRYYZkj3y%2FSg%3D%3D; Arrow Part Number: STPIC6C595TTR; Arrow Price/Stock: https://www.arrow.com/en/products/stpic6c595ttr/stmicroelectronics?region=nac
IC6 = TPS70933DBVR: Integrated Circuit; Manufacturer_Name: Texas Instruments; Datasheet Link: http://www.ti.com/lit/gpn/tps709; Height: 1.45mm; Manufacturer_Part_Number: TPS70933DBVR; Mouser Part Number: 595-TPS70933DBVR; Mouser Price/Stock: https://www.mouser.co.uk/ProductDetail/Texas-Instruments/TPS70933DBVR?qs=Z9twEOuL%252B%2FJOaGO60BtvLA%3D%3D; Arrow Part Number: TPS70933DBVR; Arrow Price/Stock: https://www.arrow.com/en/products/tps70933dbvr/texas-instruments?region=nac
J1-J3 = 31-5431: SMA
  J2: Value: ADC
J4 = B4B-PH-K-S_LF__SN_: Connector; Manufacturer_Name: JST (JAPAN SOLDERLESS TERMINALS); Manufacturer_Part_Number: B4B-PH-K-S(LF)(SN); Datasheet Link: https://datasheet.lcsc.com/szlcsc/JST-Sales-America-B4B-PH-K-S-LF-SN_C131334.pdf; Height: 6mm; Arrow Part Number: B4B-PH-K-S(LF)(SN); Arrow Price/Stock: https://www.arrow.com/en/products/b4b-ph-k-s-lf-sn/jst-manufacturing
J5 J6 = DF11-12DP-2DSA_24_: Connector; Manufacturer_Name: Hirose; Manufacturer_Part_Number: DF11-12DP-2DSA(24); Datasheet Link: https://datasheet.datasheetarchive.com/originals/distributors/SFDatasheet-7/sf-000141225.pdf; Height: 6.9mm; Mouser Part Number: 798-DF11-12DP-2DSA24; Mouser Price/Stock: https://www.mouser.co.uk/ProductDetail/Hirose-Connector/DF11-12DP-2DSA24?qs=zOgoZG1CgI9hGIQfeQgy6Q%3D%3D; Arrow Part Number: DF11-12DP-2DSA(24); Arrow Price/Stock: https://www.arrow.com/en/products/df11-12dp-2dsa-24/hirose-electric
K1-K6 K8-K11 K13-K15 K17-K28 = G5V-1-DC12: Relay or Contactor; Manufacturer_Name: Omron Electronics; Datasheet Link: https://componentsearchengine.com/Datasheets/1/G5V-1-DC12.pdf; Height: 10mm; Manufacturer_Part_Number: G5V-1-DC12; Mouser Part Number: 653-G5V-1-DC12; Mouser Price/Stock: https://www.mouser.co.uk/ProductDetail/Omron-Electronics/G5V-1-DC12?qs=nNiD76Ca0%252BuMuQOpoevaxA%3D%3D; Arrow Part Number: G5V-1-DC12; Arrow Price/Stock: https://www.arrow.com/en/products/g5v-1-dc12/omron?region=nac
K7 K12 K16 = CMP-2000-05409-1: Signal Relay, 2 A, 12 VDC, -40 to 85 degC, 8-Pin SMD, RoHS, Tape and Reel; Manufacturer: TE Connectivity; Coil Suppression Diode: No; Contact Arrangement: DPDT; Product Length (mm): 10mm; Product Height (mm): 5.65mm; Coil Voltage DC: 12V; Pick-up Voltage (Max): 9VDC; Coil Resistance: 1.029kohm; Voltage Rating (VDC): 220; Dropout Volt: 1.2VDC; Operate Time: 1ms; Contact Current Rating: 2A; Relay Construction: Non-Latching; Seal: Unsealed; Maximum Power Rating: 60W/62.5VA; Product Depth (mm): 7.5mm; Coil Current: 11.67mA; Voltage Rating (VAC): 250V; Contact Form: 2FormC; Contact Material: PalladiumRuthenium/Gold; Pin Count: 8; LED Indicator: No; Operating Temp Range: -40Cto85C; Push To Test Button: No; Mounting Style: SurfaceMount; Type: SignalRelay; Packaging: TapeandReel; Datasheet Version: Rev. 0116, 01/2016; Manufacturer URL: http://www.te.com/; Datasheet URL: http://www.te.com/commerce/DocumentDelivery/DDEController?Action=srchrtrv&DocNm=108-98001&DocType=SS&DocLang=EN; Termination Style: GullWing
L9 L10 L12 L16 L20 L23 L25 L29 L33 L37 L41 L45 L49 = CMP-14484-000220-1: SMD Inductors 100uH ±10% 0.13A 9.1Ω 0805; Shielding: Unshielded; Self Resonant Frequency: 8MHz; Saturation Current: 60mA; Core Material: Ferrite; Max DC Current: 130mA; Test Frequency: 796kHz; DC Resistance (DCR): 9.1R; Length: 0.079inch; Min Operating Temperature: -40°C; Termination: SMD/SMT; Series: CB; Inductance: 100uH; Tolerance: 10%; Height - Seated (Max): 0.057inch; Package Quantity: 3000; Radiation Hardening: No; Mount: Surface Mount; Case Code (Metric): 2012; Max Operating Temperature: 105°C; Packaging: Tape and Reel; Width: 0.049inch; RoHS Compliant: Yes; Resistor Type: Wirewound; Halogen Free: Halogen Free; Case Code (Imperial): 0805; Depth: 1.45mm; Inductance Tolerance: 10%; Number of Pins: 2; Height: 0.9mm; Current Rating: 130mA; Lead Free: Lead Free; Case/Package: 0805
L11 = CMP-06042-016438-1: Multilayer Type Inductor for General Circuits, 0805 (2012), 0.22μH, 10%, 0.38Ω, 250mA; Shielding: Shielded; Self Resonant Frequency: 220MHz; Q Factor: 20; DC Resistance (DCR): 380mR; Inductance: 220nH; Core Material: Ferrite; Test Frequency: 25MHz; Min Operating Temperature: -40°C; RoHS Compliant: Yes; Inductance Tolerance: 10%; Width: 1.25mm; Current Rating: 250mA; Rated Current-Max: 250mA; Package Quantity: 4000; Lead Free: Lead Free; Termination: SMD/SMT; Military Standard: Not; Case Code (Metric): 2012; Radiation Hardening: No; Max Operating Temperature: 85°C; Max DC Current: 250mA; Mount: Surface Mount; Length: 2mm; Packaging: Tape and Reel; Height - Seated (Max): 0.041inch; Series: LQM21N; Case Code (Imperial): 0805; Case/Package: 0805; REACH SVHC: No SVHC; Depth: 1.45mm; Tolerance: 10%; DC Current: 250mA; Number of Pins: 2; Height: 0.85mm
L13-L15 L17-L19 L21 L22 L24 L26-L28 L30-L32 L34-L36 L38-L40 L42-L44 L46-L48 = Amidon
Q1 = CMP-2000-06487-1: HEXFET(R) Power MOSFET, 3.6 A, 30 V, -55 to 150 degC, 3-Pin SOT-23, RoHS, Tape and Reel; Manufacturer: InfineonTechnologies; Drain to Source Voltage (Vdss): 30V; Gate Charge (Qg) @ Vgs: 4.8nC@4.5V; Rds On (Max) @ Id, Vgs: 64mOhm@3.6A,10V; FET Type: MOSFETP-Channel,MetalOxide; Current - Continuous Drain (Id) @ 25°C: 3.6A(Ta); Power - Max: 1.3W; Vgs(th) (Max) @ Id: 2.4V@10µA; FET Feature: Standard; Input Capacitance (Ciss) @ Vds: 388pF@25V; Operating Temperature: -55°C~150°C(TJ); Series: HEXFET®; Family: Transistors-FETs,MOSFETs-Single; Manufacturer URL: http://www.infineon.com/; Package Reference: SOT-23-3; Datasheet Version: 02/2012; Category: DiscreteSemiconductorProducts; Part Status: Active; Mounting Technology: SurfaceMount; Datasheet URL: http://www.infineon.com/dgdl/irlml9301pbf.pdf?fileId=5546d462533600a401535668e5e42640; Supplier Device Package: Micro3™/SOT-23; Mounting Type: SurfaceMount; Packaging: Tape&Reel(TR); Package / Case: TO-236-3,SC-59,SOT-23-3; Package Description: 3-Pin Small Outline Transistor, Body 2.92 x 1.3 mm, Pitch 0.95 mm
R1-R9 = RES semi: Chip Resistor; Manufacturer: Yageo/Phycomp; Manufacturer P/N: RC0603FR-0749R9L; numsch: 021; TypeNum: 212; Parameters: 49.9R, RC, 0.1W, ±1%, TCR ±100ppm; Power: *; TCR: *; Series: *; Tolerance: *
U1 = CMP-0395-00332-2: Single Output High PSRR LDO, 1 A, Fixed 5 V Output, 2.7 to 5.5 V Input, 6-pin SOT-223 (DCQ), -40 to 125 degC, Green (RoHS & no Sb/Br); Manufacturer: Texas Instruments; Vout Adj(Max)(V): 5; Iout(Max)(A): 1; Accuracy(%): 2; Vin(Max)(V): 5.5; SubFamily: Single Channel LDO; Iq(Typ)(mA): 0.26; Vin(Min)(V): 2.7; Vdo(Typ)(mV): 200; Fixed Output Options(V): 5; Eco-Plan: Green (RoHS & no Sb/Br); ComponentLink2URL: http://www.ti.com/general/docs/lit/getliterature.tsp?genericPartNumber=TPS79650&fileType=pdf; PartNumber: TPS79650DCQR; Vout Adj(Min)(V): 5; PackageDescription: 6-Pin Plastic Small Outline, Body 3.5 x 6.5 mm, Pitch 1.27 mm; ComponentLink3URL: http://www.ti.com/litv/pdf/mpds098c; ComponentLink1URL: http://www.ti.com/; ComponentLink3Description: Package Specification; ComponentLink1Description: Manufacturer URL; PackageReference: DCQ0006A; ComponentLink2Description: Datasheet; Mounting Technology: Surface Mount; DatasheetVersion: SLVS351N; PackageVersion: 4202109/D